# EAGLE design Дюзи (EAGLE 5.11)
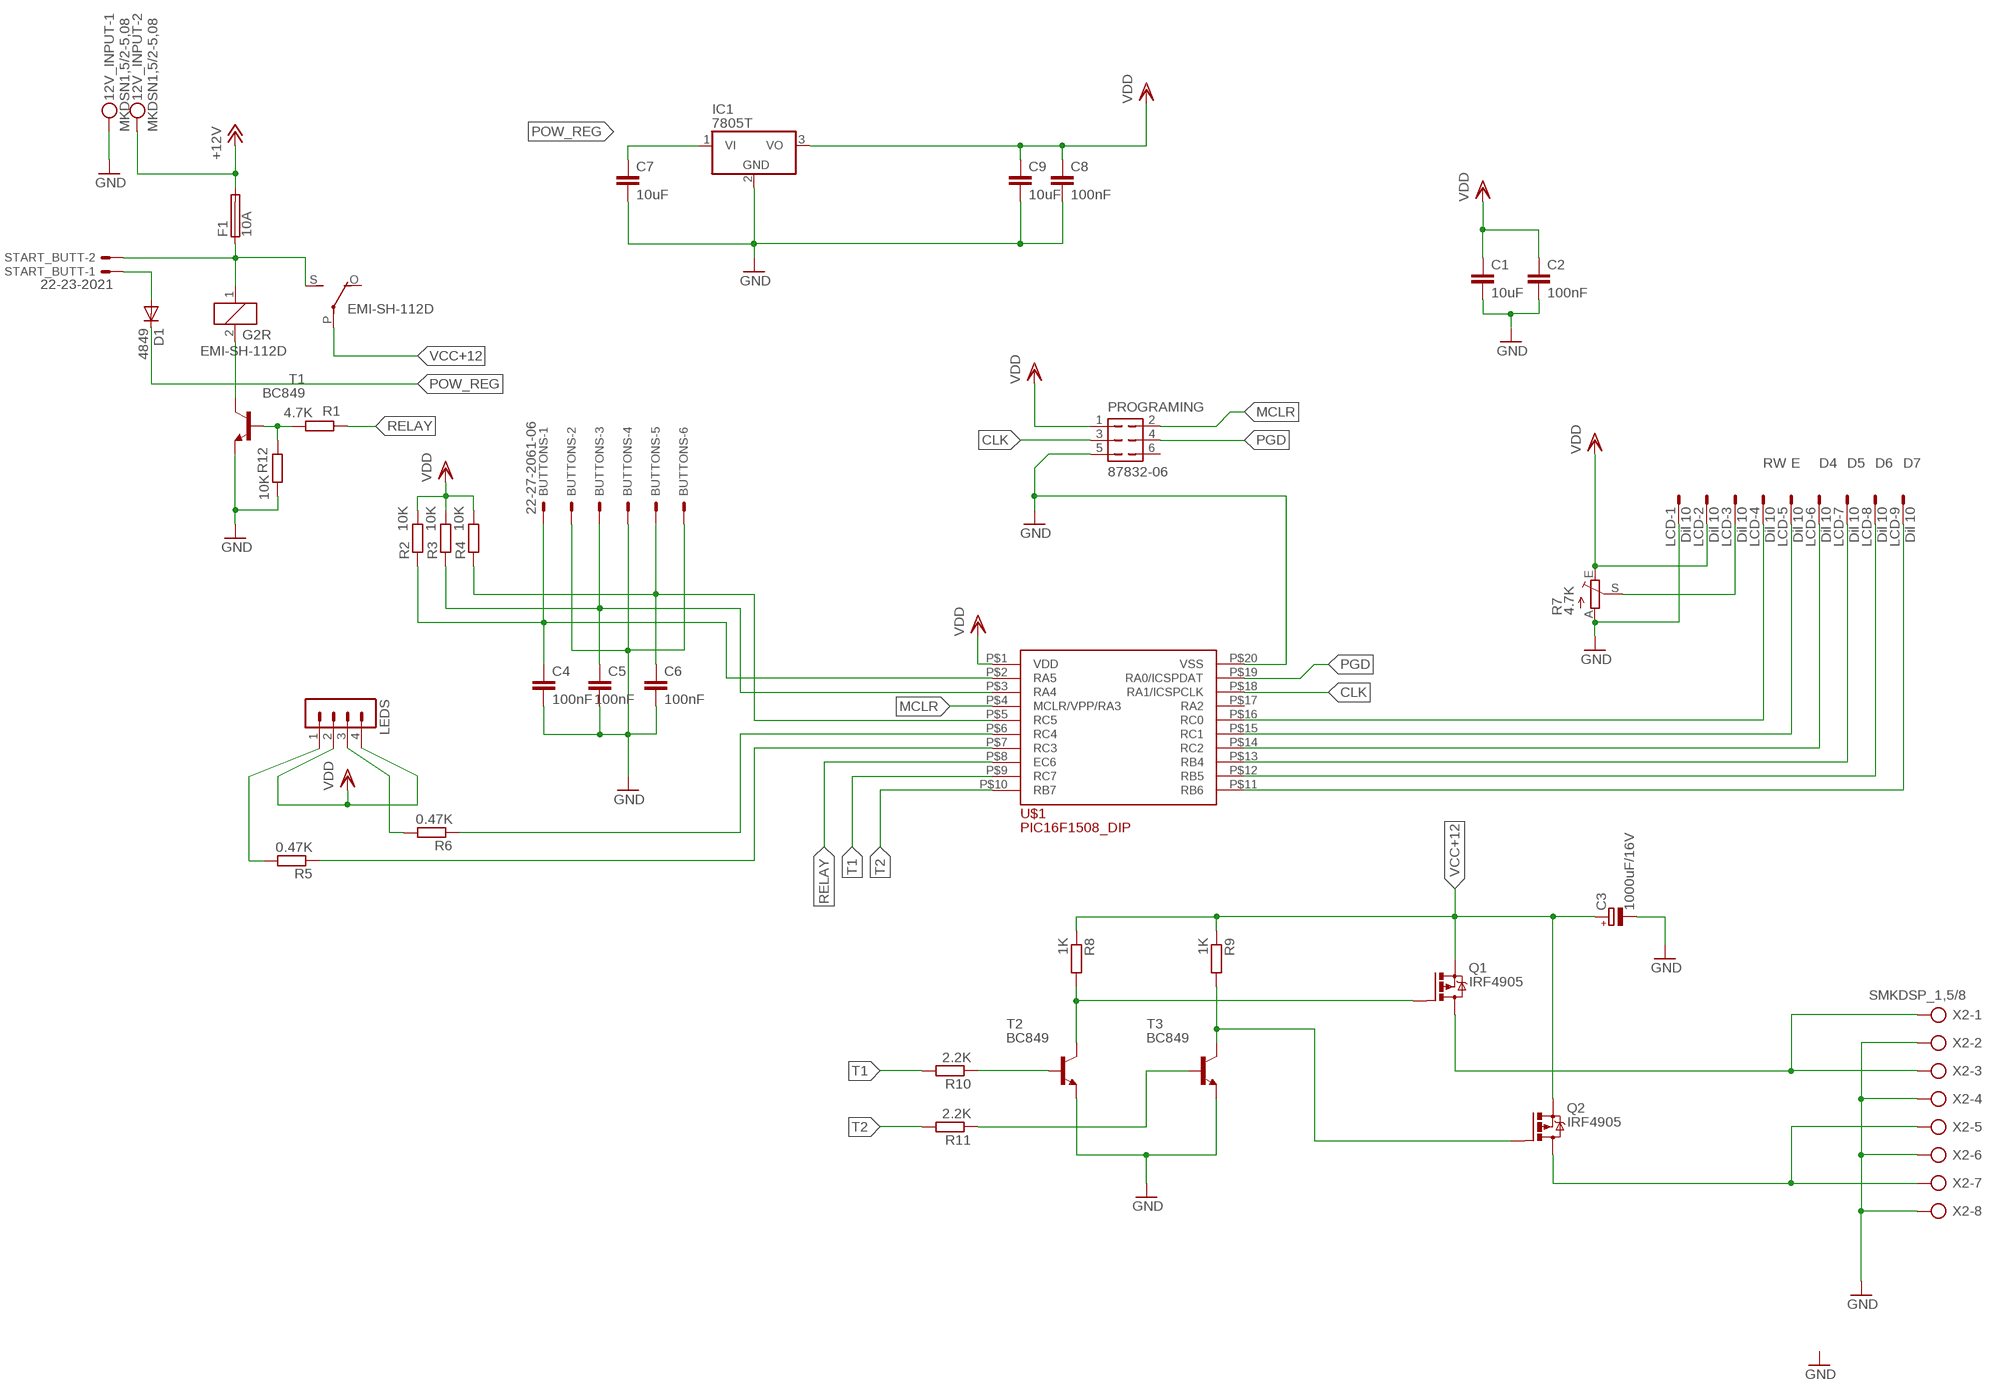
[diagram p0: schematic, sheet 1]

## Parts
12V_INPUT  MKDSN1,5/2-5,08  [MKDSN1,5/2-5,08]
BUTTONS  22-27-2061-06  [6410-06]
C1  10uF  C-EUC1206  [C1206]
C2  100nF  C-EUC1206  [C1206]
C3  1000uF/16V  CPOL-EUE2.5-7  [E2,5-7]
C4  100nF  C-EUC1206  [C1206]
C5  100nF  C-EUC1206  [C1206]
C6  100nF  C-EUC1206  [C1206]
C7  10uF  C-EUC1206  [C1206]
C8  100nF  C-EUC1206  [C1206]
C9  10uF  C-EUC1206  [C1206]
D1  4849  DIODE-D-5  [D-5]
EMI-SH-112D  G2R  [G2R]
F1  10A  GSH15  [GSH15]
IC1  7805T  [TO220H]
LCD  Dil 10  14E  [14P]
LEDS  MA04-1  [MA04-1]
PROGRAMING  87832-06  [87832-06]
Q1  IRF4905  [TO220BH]
Q2  IRF4905  [TO220BH]
R1  4.7K  R-EU_M1206  [M1206]
R2  10K  R-EU_M1206  [M1206]
R3  10K  R-EU_M1206  [M1206]
R4  10K  R-EU_M1206  [M1206]
R5  0.47K  R-EU_M1206  [M1206]
R6  0.47K  R-EU_M1206  [M1206]
R7  4.7K  TRIM_EU-S64W  [S64W]
R8  1K  R-EU_M1206  [M1206]
R9  1K  R-EU_M1206  [M1206]
R10  2.2K  R-EU_M1206  [M1206]
R11  2.2K  R-EU_M1206  [M1206]
R12  10K  R-EU_M1206  [M1206]
START_BUTT  22-23-2021  [22-23-2021]
T1  BC849  [SOT23]
T2  BC849  [SOT23]
T3  BC849  [SOT23]
U$1  PIC16F1508_DIPDIP20  [DIP20]
X2  SMKDSP_1,5/8  [SMKDSP_1,5/8]

## Nets
+12V [Power]: 12V_INPUT.2 F1.2
CLK: PROGRAMING.3 U$1.P$18(RA1/ICSPCLK)
D4: LCD.6 U$1.P$14(RC2)
D5: LCD.7 U$1.P$13(RB4)
D6: LCD.8 U$1.P$12(RB5)
D7: LCD.9 U$1.P$11(RB6)
E: LCD.5 U$1.P$15(RC1)
GND: 12V_INPUT.1 BUTTONS.2 BUTTONS.4 BUTTONS.6 C1.2 C2.2 C3.- C4.2 C5.2 C6.2 C7.2 C8.2 C9.2 IC1.2(GND) LCD.1 PROGRAMING.5 R7.A R12.2 T1.2(E) T2.2(E) T3.2(E) U$1.P$20(VSS) X2.2 X2.4 X2.6 X2.8
LCD_DISPLAY: LCD.3 R7.S
LED1: LEDS.1 R5.2
LED2: LEDS.3 R6.2
MCLR: PROGRAMING.2 U$1.P$4(MCLR/VPP/RA3)
N$1: D1.A START_BUTT.1
N$3 [Power]: Q1.D X2.1 X2.3
N$4 [Power]: Q2.D X2.5 X2.7
N$6: BUTTONS.1 C4.1 R2.1 U$1.P$2(RA5)
N$7: BUTTONS.3 C5.1 R3.1 U$1.P$3(RA4)
N$8: BUTTONS.5 C6.1 R4.1 U$1.P$5(RC5)
N$9: R5.1 U$1.P$7(RC3)
N$10: R6.1 U$1.P$6(RC4)
N$11: EMI-SH-112D.1 EMI-SH-112D.S(2:S) F1.1 START_BUTT.2
N$12: EMI-SH-112D.2 T1.3(C)
N$15: R1.2 R12.1 T1.1(B)
N$17: Q1.G R8.2 T2.3(C)
N$18: Q2.G R9.2 T3.3(C)
N$22: R10.1 T2.1(B)
N$24: R11.1 T3.1(B)
PGD: PROGRAMING.4 U$1.P$19(RA0/ICSPDAT)
POW_REG: C7.1 D1.C IC1.1(VI)
RELAY: R1.1 U$1.P$8(EC6)
RW: LCD.4 U$1.P$16(RC0)
T1: R10.2 U$1.P$9(RC7)
T2: R11.2 U$1.P$10(RB7)
VCC+12: C3.+ EMI-SH-112D.P(2:P) Q1.S Q2.S R8.1 R9.1
VDD: C1.1 C2.1 C8.1 C9.1 IC1.3(VO) LCD.2 LEDS.2 LEDS.4 PROGRAMING.1 R2.2 R3.2 R4.2 R7.E U$1.P$1(VDD)
Unconnected: EMI-SH-112D.O(2:O) LCD.10 LCD.11 LCD.12 LCD.13 LCD.14 PROGRAMING.6 U$1.P$17(RA2)

## Library data of the parts
12V_INPUT = con-phoenix-508:MKDSN1,5/2-5,08: MKDSN 1,5/ 2-5,08 Printklemme Nennstrom: 13,5 A Nennspannung: 250 V Rastermaß: 5,08 mm Polzahl: 2 Anschlussart: Schraubanschluss Montage: Löten Anschlussrichtung Leiter/Platine: 0 ° Artikelnummer: 1729128 Source: http://eshop.phoenixcontact.com .. 1729128.pdf; MPN: MKDSN 1,5/2-5.08; OC_FARNELL: 1792903; OC_NEWARK: 30M2397
BUTTONS = con-molex:22-?-06: CONNECTOR wire to board 2.54 mm (.1 inch) pitch header; OC_FARNELL: unknown; OC_NEWARK: unknown
C1 C2 C4-C9 = resistor:C-EU: CAPACITOR, European symbol
C3 = resistor:CPOL-EU: POLARIZED CAPACITOR, European symbol
D1 = diode:DIODE-: DIODE
EMI-SH-112D = relay:G2R: RELAY 1 x switch, Omron; OC_FARNELL: 1569185; OC_NEWARK: unknown
F1 = fuse:GSH15: FUSE HOLDER grid 15mm, 19649 Wickmann; MPN: 64900001039; OC_FARNELL: 1271673; OC_NEWARK: 02P0318
IC1 = linear:78*: Positive VOLTAGE REGULATOR Source: http://cache.national.com/ds/LM/LM78L05.pdf http://www.fairchildsemi.com/ds/LM/LM7805.pdf
LCD = con-dil:14E: DIL CABLE CONNECTOR
LEDS = con-lstb:MA04-1: PIN HEADER; OC_FARNELL: unknown; OC_NEWARK: unknown
PROGRAMING = con-molex:87832-06: Milli-Grid Header 2.00mm (.079") Pitch; OC_FARNELL: 1756947; OC_NEWARK: unknown
Q1 Q2 = transistor-power:IRF4905: P-Channel HEXFET® Power MOSFET RDS(on)= 0.02 Ohm, ID = -74A Source: http://www.irf.com/product-info/datasheets/data/irf4905pbf.pdf
R1-R6 R8-R12 = resistor:R-EU_: RESISTOR, European symbol
R7 = pot:TRIM_EU-: POTENTIOMETER
START_BUTT = con-molex:22-23-2021: .100" (2.54mm) Center Header - 2 Pin; MF: MOLEX; MPN: 22-23-2021; OC_FARNELL: 1462926; OC_NEWARK: 25C3832
T1-T3 = transistor:BC849: NPN TRANSISTOR
U$1 = PIC:PIC16F1508_DIP
X2 = con-phoenix-smkdsp:SMKDSP_1,5/8: Printklemme, Nennstrom: 17,5 A, Bemessungsspannung: 250 V, Raster: 5,0 mm Source: http://eshop.phoenixcontact.de .. 1733415.pdf; MF: FARNELL; MPN: 1733635; OC_FARNELL: 3041281; OC_NEWARK: 71C4133

## Net classes
1 Power: width 2.54 mm

## Board
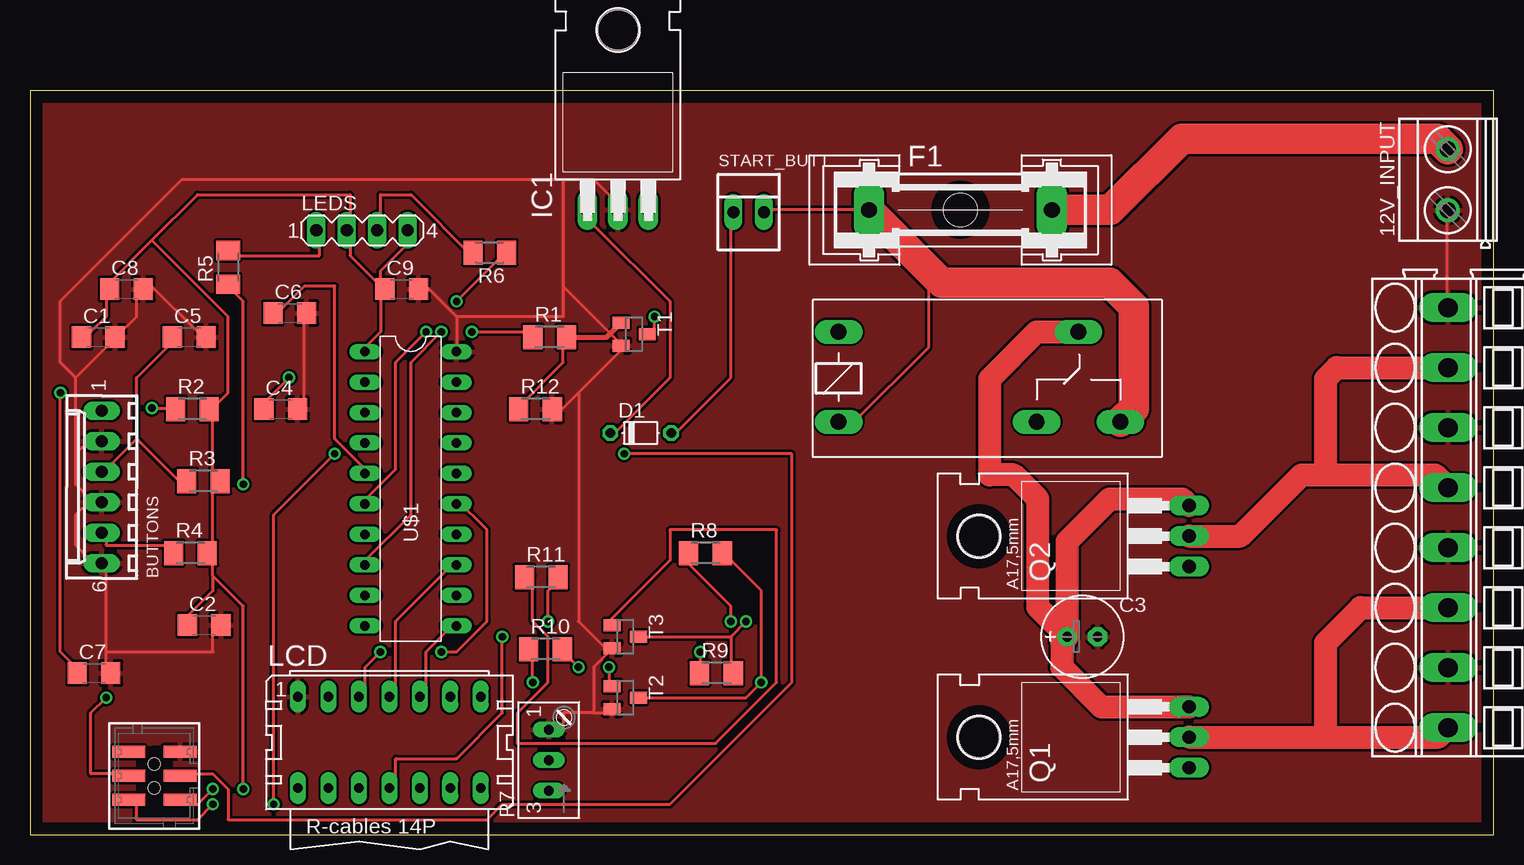
[diagram p1: board, top side]
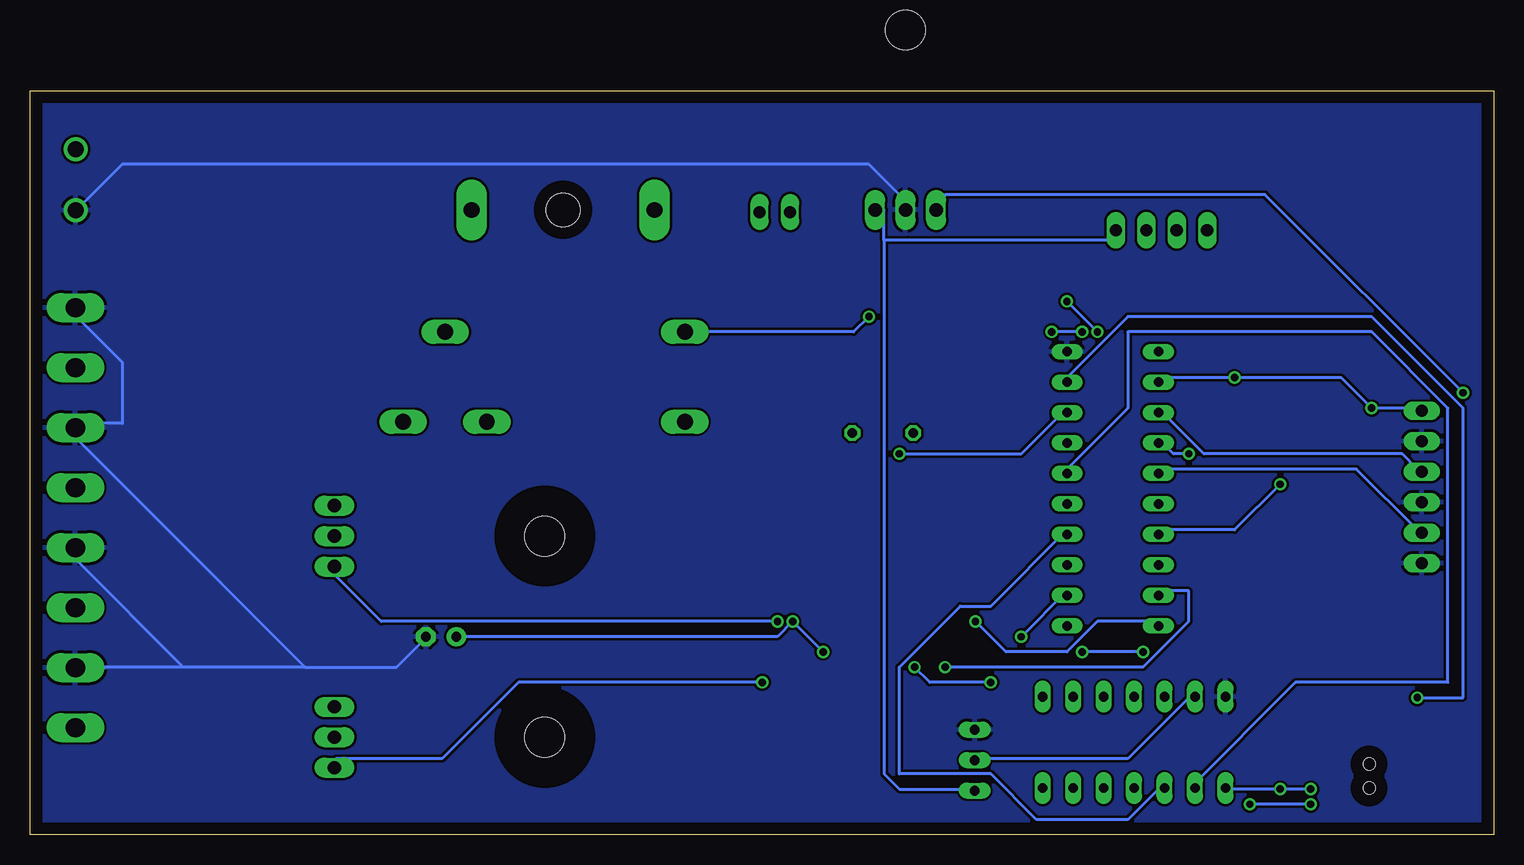
[diagram p2: board, bottom side, seen from below]

Size 122 x 62 mm. Coordinates in mm from the lower left corner, seen from the top.
Outline: 0,0 122,0 122,62 0,62 0,0
Copper layers (1*16): Top 0.035mm / dielectric 1.5mm / Bottom 0.035mm
Design rules "default": minimum track width 10mil, minimum drill 24mil, track to track 8mil, track to pad 8mil, pad to pad 8mil, via to via 8mil, smd to smd 8mil, copper to edge 40mil, drill to drill 8mil, minimum pad ring 10mil, minimum via ring 8mil, stop-mask expansion 4mil, vias tented up to drill 0mil, thermal gap 10mil

### Footprints (pad centres in the part's own frame; a part is rotated, then mirrored left to right if it is on the bottom)
MKDSN1,5/2-5,08 = drill 1.3 pad 2 round: 1 -2.561,0.025; 2 2.519,0.025
6410-06 = drill 1.016 long: 1 6.35,0; 2 3.81,0; 3 1.27,0; 4 -1.27,0; 5 -3.81,0; 6 -6.35,0
C1206 = smd 1.6 x 1.8: 1 -1.4,0; 2 1.4,0
E2,5-7 = drill 0.813 pad 1.6 round: + -1.27,0 | drill 0.813 pad 1.6 octagon: - 1.27,0
D-5 = drill 0.813 octagon: A 2.54,0; C -2.54,0
G2R = drill 1.321 long: 1 -2.54,-3.683; 2 -2.54,3.81; O 13.97,-3.683; P 17.45,3.81; S 20.955,-3.683
GSH15 = drill 1.321 pad 2.54 long: 1 -7.62,0; 2 7.62,0 | hole 2.794: 0,0
TO220H = drill 1.118 long: 1 -2.54,-10.16; 2 0,-10.16; 3 2.54,-10.16 | hole 3.302: 0,4.826
14P = drill 0.813 long: 1 -7.62,3.81; 2 -7.62,-3.81; 3 -5.08,3.81; 4 -5.08,-3.81; 5 -2.54,3.81; 6 -2.54,-3.81; 7 0,3.81; 8 0,-3.81; 9 2.54,3.81; 10 2.54,-3.81; 11 5.08,3.81; 12 5.08,-3.81; 13 7.62,3.81; 14 7.62,-3.81
MA04-1 = drill 1.016 long: 1 -3.81,0; 2 -1.27,0; 3 1.27,0; 4 3.81,0
87832-06 = smd 1 x 2.75: 1 -2,-2.15; 2 -2,2.15; 3 0,-2.15; 4 0,2.15; 5 2,-2.15; 6 2,2.15 | hole 1: -1,0; 1,0
TO220BH = drill 1.118 long: D 0,-6.35; G -2.54,-6.35; S 2.54,-6.35 | hole 3.302: 0,11.176
M1206 = smd 1.6 x 2: 1 -1.4,0; 2 1.4,0
S64W = drill 0.813 long: A 2.54,1.27; E -2.54,1.27; S 0,1.27
22-23-2021 = drill 1 long: 1 -1.27,0; 2 1.27,0
SOT23 = smd 1 x 1.4: 1 -0.95,-1.1; 2 0.95,-1.1; 3 0,1.1
DIP20 = drill 0.8 long: P$1 -292.1,127; P$2 -292.1,124.46; P$3 -292.1,121.92; P$4 -292.1,119.38; P$5 -292.1,116.84; P$6 -292.1,114.3; P$7 -292.1,111.76; P$8 -292.1,109.22; P$9 -292.1,106.68; P$10 -292.1,104.14; P$11 -284.48,104.14; P$12 -284.48,106.68; P$13 -284.48,109.22; P$14 -284.48,111.76; P$15 -284.48,114.3; P$16 -284.48,116.84; P$17 -284.48,119.38; P$18 -284.48,121.92; P$19 -284.48,124.46; P$20 -284.48,127
SMKDSP_1,5/8 = drill 1.6 pad 1.8 long: 1 -2.5,0; 2 2.5,0; 3 7.5,0; 4 12.5,0; 5 17.5,0; 6 22.5,0; 7 27.5,0; 8 32.5,0

### Placement (x,y rotation side)
12V_INPUT  118.21,54.61 90 top
BUTTONS  5.98,28.98 90 top
C1  5.69,41.48 0 top
C2  14.52,17.48 0 top
C3  87.73,16.51 0 top
C4  20.9,35.48 0 top
C5  13.28,41.48 0 top
C6  21.66,43.48 0 top
C7  5.34,13.48 0 top
C8  8.04,45.48 0 top
C9  30.99,45.48 0 top
D1  50.91,33.48 0 top
EMI-SH-112D  69.95,38.1 0 top
F1  77.57,52.07 0 top
IC1  49.01,62.24 0 top
LCD  29.96,7.7 0 top
LEDS  27.68,50.37 0 top
PROGRAMING  10.36,4.9 90 top
Q1  90.27,8.13 90 top
Q2  90.27,24.89 90 top
R1  43.32,41.48 0 top
R2  13.54,35.48 0 top
R3  14.46,29.48 0 top
R4  13.38,23.48 0 top
R5  16.52,47.29 90 top
R6  38.33,48.52 180 top
R7  44.52,6.22 90 top
R8  56.3,23.48 0 top
R9  57.22,13.48 0 top
R10  42.97,15.48 0 top
R11  42.62,21.48 0 top
R12  42.14,35.48 0 top
START_BUTT  59.91,51.89 0 top
T1  50.36,41.72 270 top
T2  49.63,11.43 270 top
T3  49.63,16.51 270 top
U$1  320.03,-86.73 0 top
X2  118.21,11.43 90 top

### Tracks (layer width: path | path; a pad name or v marks a point on that pad's centre or on a via)
+12V
  Top 2.54: F1.2 90.07,52.07 96,58 117.31,58 12V_INPUT.2
CLK  (via drill 0.61)
  Top 0.254: v49.53,31.75 63.5,31.75 63.5,12.7 53.34,2.54 39.37,2.54 38.1,1.27 16.51,1.27 16.51,3.81 15.24,5.08 12.7,5.08 PROGRAMING.3
  Bottom 0.254: v49.53,31.75 39.37,31.75 35.56,35.56 U$1.P$18
D4
  Bottom 0.254: U$1.P$14 35.56,25.4 41.91,19.05 44.45,19.05 49.53,13.97 49.53,5.08 41.91,5.08 38.1,1.27 30.48,1.27 27.94,3.81 LCD.6
D5
  Top 0.254: U$1.P$13 35.56,22.86 30.48,17.78 30.48,11.43 LCD.7
D6  (via drill 0.61)
  Top 0.254: v39.37,16.51 39.37,10.16 35.56,6.35 30.48,6.35 30.48,3.81 LCD.8
  Bottom 0.254: v39.37,16.51 35.56,20.32 U$1.P$12
D7
  Top 0.254: U$1.P$11 35.56,17.78 33.02,15.24 33.02,11.43 LCD.9
E  (via drill 0.61)
  Top 0.254: v34.29,15.24 35.56,15.24 38.1,17.78 38.1,25.4 35.56,27.94 U$1.P$15 | v29.21,15.24 27.94,13.97 27.94,11.43 LCD.5
  Bottom 0.254: v29.21,15.24 v34.29,15.24
GND
  Top 0.254: 12V_INPUT.1 118.11,52.07 118.11,44.45 X2.8 | C5.2 13.97,41.91 10.16,45.72 C8.2 8.89,45.72 8.89,43.18 7.62,41.91 C1.2 6.35,40.64 3.81,38.1 | 5.08,27.94 3.81,29.21 3.81,31.75 | 3.81,31.75 5.08,33.02 BUTTONS.2 | 6.35,15.24 6.35,22.86 BUTTONS.6 5.08,22.86 3.81,24.13 3.81,26.67 5.08,27.94 | 6.35,15.24 6.35,13.97 C7.2 | 5.08,27.94 BUTTONS.4 | 3.81,31.75 3.81,38.1 | C4.2 22.86,35.56 22.86,43.18 C6.2 | 6.35,15.24 15.24,15.24 15.24,17.78 C2.2 | 46.99,10.16 44.45,10.16 44.45,8.89 R7.A | 46.99,10.16 48.26,10.16 T2.2 | 48.26,15.24 46.99,13.97 46.99,10.16 | 35.56,43.18 33.02,45.72 C9.2 | 35.56,43.18 35.56,40.64 U$1.P$20 | 45.72,36.83 44.45,35.56 43.18,35.56 R12.2 | 49.53,40.64 45.72,36.83 | 44.45,54.61 46.99,54.61 48.26,53.34 IC1.2 | 44.45,54.61 44.45,45.72 | 44.45,45.72 49.53,40.64 | 49.53,40.64 T1.2 | 35.56,43.18 44.45,43.18 44.45,45.72 | 48.26,15.24 45.72,17.78 45.72,36.83 | 48.26,15.24 T3.2 | 3.81,38.1 2.54,39.37 2.54,44.45 12.7,54.61 44.45,54.61
  Bottom 0.254: 109.22,13.97 118.11,13.97 X2.2 | 99.06,13.97 109.22,13.97 | 99.06,13.97 91.44,13.97 88.9,16.51 C3.- | 109.22,13.97 118.11,22.86 X2.4 | 99.06,13.97 118.11,33.02 X2.6 118.11,34.29 114.3,34.29 114.3,39.37 118.11,43.18 X2.8 | 12V_INPUT.1 118.11,52.07 114.3,55.88 52.07,55.88 49.53,53.34 IC1.2
  pour Top: 0,62 0,0 122,0 122,62
  pour Bottom: 0,62 122,62 122,0 0,0
LCD_DISPLAY
  Bottom 0.254: LCD.3 25.4,11.43 30.48,6.35 43.18,6.35 R7.S
LED1
  Top 0.254: R5.2 16.51,48.26 24.13,48.26 24.13,49.53 LEDS.1
LED2
  Top 0.254: R6.2 36.83,48.26 31.75,53.34 29.21,53.34 29.21,50.8 LEDS.3
MCLR  (via drill 0.61)
  Top 0.254: v25.4,31.75 20.32,26.67 v20.32,2.54 | v15.24,2.54 13.97,1.27 8.89,1.27 8.89,2.54 PROGRAMING.2
  Bottom 0.254: v25.4,31.75 26.67,31.75 27.94,33.02 U$1.P$4 | v15.24,2.54 v20.32,2.54
N$1
  Top 0.254: D1.A 53.34,33.02 58.42,38.1 58.42,50.8 START_BUTT.1
N$3
  Top 1.93: Q1.D 108,8.13 | 108,8.13 117.41,8.13 X2.1 | X2.3 110.93,18.93 108,16 108,8.13
N$4
  Top 1.93: Q2.D 100.89,24.89 106,30 108,30 | 108,30 117.14,30 X2.5 | X2.7 108.93,38.93 108,38 108,30
N$6  (via drill 0.61)
  Top 0.254: v10.16,35.56 11.43,35.56 R2.1 | v21.59,38.1 19.05,35.56 C4.1
  Bottom 0.254: BUTTONS.1 6.35,35.56 v10.16,35.56 12.7,38.1 v21.59,38.1 27.94,38.1 U$1.P$2
N$7
  Top 0.254: 8.89,33.02 8.89,38.1 11.43,40.64 C5.1 | 8.89,33.02 6.35,30.48 BUTTONS.3 | 8.89,33.02 12.7,29.21 R3.1
  Bottom 0.254: U$1.P$3 27.94,35.56 24.13,31.75 7.62,31.75 6.35,30.48 BUTTONS.3
N$8
  Top 0.254: R4.1 11.43,24.13 6.35,24.13 6.35,25.4 BUTTONS.5 | C6.1 20.32,43.18 22.86,45.72 25.4,45.72 25.4,33.02 27.94,30.48 U$1.P$5
  Bottom 0.254: BUTTONS.5 6.35,25.4 11.43,30.48 27.94,30.48 U$1.P$5
N$9  (via drill 0.61)
  Top 0.254: v17.78,29.21 17.78,44.45 16.51,45.72 R5.1
  Bottom 0.254: v17.78,29.21 21.59,25.4 27.94,25.4 U$1.P$7
N$10  (via drill 0.61)
  Top 0.254: v35.56,44.45 39.37,48.26 R6.1 | v33.02,41.91 30.48,39.37 30.48,30.48 27.94,27.94 U$1.P$6
  Bottom 0.254: v33.02,41.91 v35.56,44.45
N$11
  Top 0.254: START_BUTT.2 60.96,52.07 F1.1 | EMI-SH-112D.1 68.58,34.29 74.93,40.64 74.93,45.72 75.61,46.4
  Top 2.54: F1.1 69.95,52.05 75.61,46.4 76,46 90,46 92,44 92,35.51 EMI-SH-112D.S
N$12  (via drill 0.61)
  Top 0.254: v52.07,43.18 52.07,41.91 T1.3
  Bottom 0.254: v52.07,43.18 53.34,41.91 EMI-SH-112D.2
N$15
  Top 0.254: R12.1 40.64,35.56 44.45,39.37 44.45,40.64 R1.2
  Top 0.406: R1.2 48.07,41.48 T1.1
N$17  (via drill 0.61)
  Top 0.254: T2.3 59.69,11.43 v60.96,12.7 60.96,20.32 58.42,22.86 R8.2
  Bottom 0.254: v60.96,12.7 81.28,12.7 87.63,6.35 96.52,6.35 Q1.G
N$18  (via drill 0.61)
  Top 0.254: 58.42,16.51 58.42,13.97 R9.2 | T3.3 58.42,16.51 | 58.42,16.51 v59.69,17.78
  Bottom 0.254: v59.69,17.78 92.71,17.78 96.52,21.59 Q2.G
N$22  (via drill 0.61)
  Top 0.254: v48.26,13.97 48.26,12.7 T2.1 | v41.91,12.7 41.91,15.24 R10.1
  Bottom 0.254: v48.26,13.97 46.99,12.7 v41.91,12.7
N$24
  Top 0.254: T3.1 48.26,17.78 53.34,22.86 53.34,25.4 62.23,25.4 62.23,12.7 57.15,7.62 40.64,7.62 40.64,10.16 43.18,12.7 43.18,16.51 41.91,17.78 41.91,21.59 R11.1
PGD  (via drill 0.61)
  Top 0.254: v6.35,11.43 5.08,10.16 5.08,5.08 7.62,5.08 PROGRAMING.4
  Bottom 0.254: v6.35,11.43 2.54,11.43 2.54,35.56 10.16,43.18 30.48,43.18 35.56,38.1 U$1.P$19
POW_REG  (via drill 0.61)
  Top 0.254: v2.54,36.83 2.54,15.24 3.81,13.97 C7.1 | D1.C 48.26,33.02 53.34,38.1 53.34,44.45 46.99,50.8 46.99,52.07 IC1.1
  Bottom 0.254: v2.54,36.83 19.05,53.34 45.72,53.34 IC1.1
RELAY  (via drill 0.61)
  Top 0.254: v36.83,41.91 41.91,41.91 R1.1 | v34.29,41.91 31.75,39.37 31.75,26.67 27.94,22.86 U$1.P$8
  Bottom 0.254: v34.29,41.91 v36.83,41.91
RW
  Bottom 0.254: U$1.P$16 35.56,30.48 30.48,35.56 30.48,41.91 10.16,41.91 3.81,35.56 3.81,12.7 16.51,12.7 25.4,3.81 LCD.4
T1  (via drill 0.61)
  Top 0.254: v45.72,13.97 44.45,15.24 R10.2
  Bottom 0.254: v45.72,13.97 29.21,13.97 25.4,17.78 25.4,20.32 27.94,20.32 U$1.P$9
T2  (via drill 0.61)
  Top 0.254: v43.18,17.78 43.18,20.32 44.45,21.59 R11.2
  Bottom 0.254: v43.18,17.78 40.64,15.24 35.56,15.24 33.02,17.78 27.94,17.78 U$1.P$10
VCC+12  (via drill 0.61)
  Top 0.254: v58.42,17.78 58.42,19.05 54.61,22.86 R8.1 | v55.88,15.24 55.88,13.97 R9.1
  Top 1.93: EMI-SH-112D.P 83.91,41.91 80,38 80,30 82,30 84,28 84,18.97 C3.+ | C3.+ 86.46,24.46 90,28 96.05,28 Q2.S | Q1.S 89.33,10.67 86,14 86,16.05 C3.+
  Bottom 0.254: C3.+ 59.69,16.51 v58.42,17.78 v55.88,15.24
VDD  (via drill 0.61)
  Top 0.254: 15.24,21.59 15.24,20.32 12.7,17.78 C2.1 | 15.24,21.59 15.24,22.86 R4.2 15.24,24.13 15.24,29.21 | 15.24,29.21 15.24,35.56 | 15.24,29.21 R3.2 | 6.35,45.72 6.35,43.18 5.08,41.91 C1.1 | 29.21,45.72 26.67,48.26 26.67,49.53 LEDS.2 26.67,50.8 26.67,53.34 13.97,53.34 10.16,49.53 | 29.21,45.72 29.21,41.91 27.94,40.64 U$1.P$1 | 29.21,45.72 29.21,46.99 31.75,49.53 LEDS.4 | 29.21,45.72 C9.1 | 10.16,49.53 6.35,45.72 | 6.35,45.72 C8.1 | 15.24,35.56 16.51,36.83 16.51,43.18 10.16,49.53 | 15.24,35.56 R2.2 | v15.24,3.81 13.97,2.54 12.7,2.54 PROGRAMING.1 | v17.78,3.81 17.78,19.05 15.24,21.59
  Bottom 0.254: 50.8,49.53 50.8,52.07 IC1.3 | 50.8,49.53 31.75,49.53 LEDS.4 | 50.8,49.53 50.8,5.08 49.53,3.81 44.45,3.81 R7.E | v15.24,3.81 v17.78,3.81 22.86,3.81 LCD.2